# Altium project IMU_standalone.PrjPcb
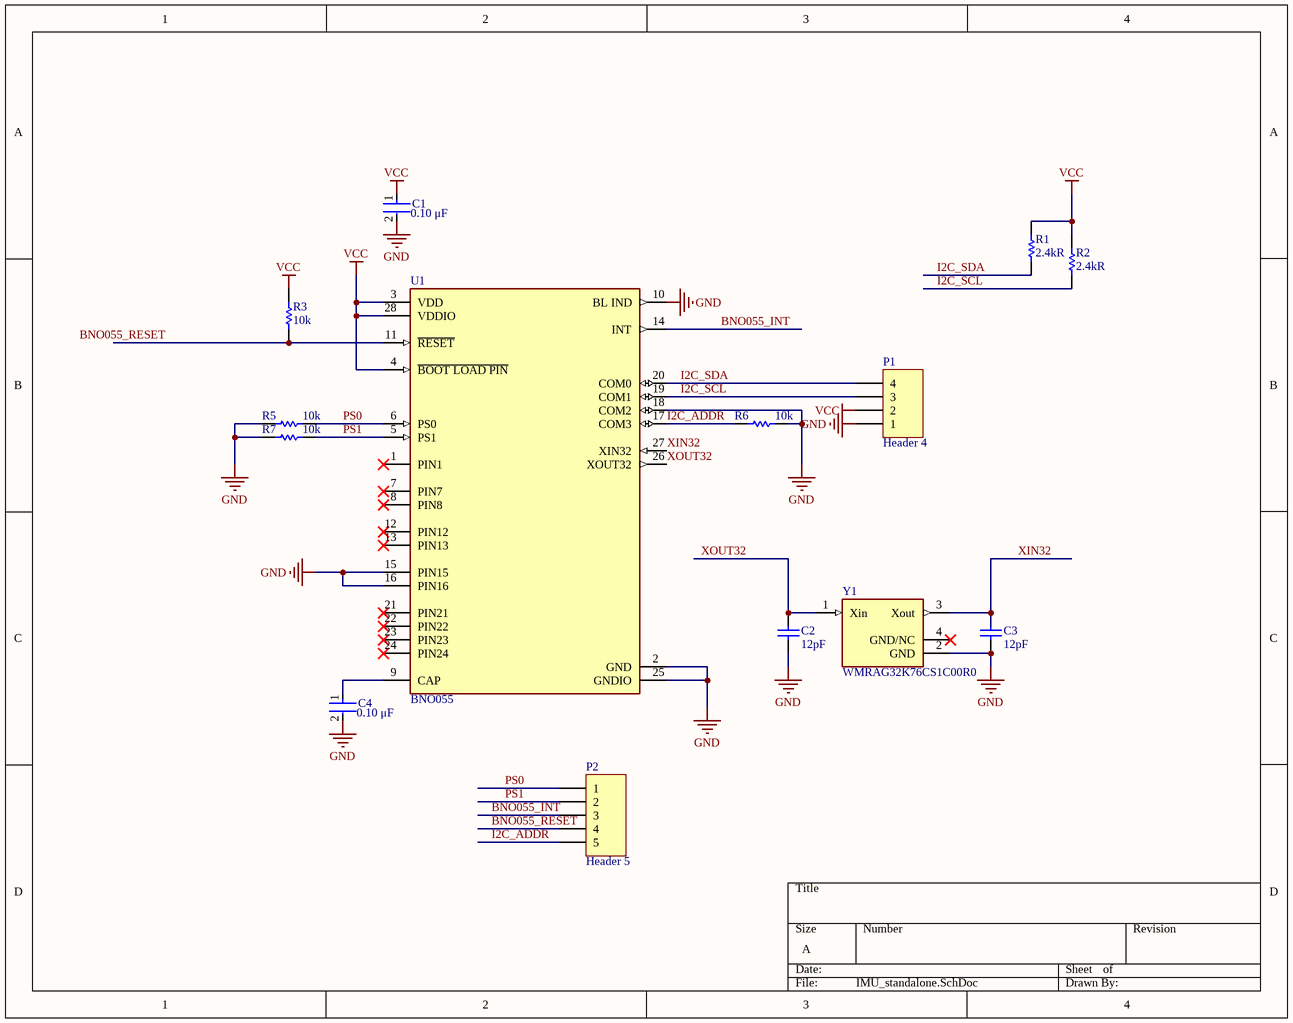
[diagram p0: IMU_standalone.SchDoc]
1 sheet, 14 parts. Net scope: global (net labels, ports and power ports of the same name join across sheets).
Board file: IMU_standalone.PcbDoc

## Sheet IMU_standalone.SchDoc
size A

### Parts
C1  Capacitance: 0.10 μF  [FP-C0603C-CF-MFG]  (hidden comment: C0603C104M4RAC7411)
C2  value 12pF  [CAPC1608X90X40NL10T20]  (hidden comment: CC0603JRNPO9BN120)
C3  value 12pF  [CAPC1608X90X40NL10T20]  (hidden comment: CC0603JRNPO9BN120)
C4  Capacitance: 0.10 μF  [FP-C0603C-CF-MFG]  (hidden comment: C0603C104M4RAC7411)
P1  Header 4  [HDR1X4]
P2  Header 5  [HDR1X5]
R1  value 2.4kR  [RESC1608X50X30ML20T20]  (hidden comment: RR0816P-242-D)
R2  value 2.4kR  [RESC1608X50X30ML20T20]  (hidden comment: RR0816P-242-D)
R3  value 10k  [RESC1609X55X30LL15T15]  (hidden comment: ERJ3EKF1002V)
R5  value 10k  [RESC1609X55X30LL15T15]  (hidden comment: ERJ3EKF1002V)
R6  value 10k  [RESC1609X55X30LL15T15]  (hidden comment: ERJ3EKF1002V)
R7  value 10k  [RESC1609X55X30LL15T15]  (hidden comment: ERJ3EKF1002V)
U1  BNO055  [FP-BNO055-MFG]
Y1  WMRAG32K76CS1C00R0  [FP-WMRAG32K76CS1C00R0-MFG]

### Nets
GND: C1.2 C2.1 C3.1 C4.2 P1.1 R5.1 R6.1 R7.1 U1.2(GND) U1.10(BL_IND) U1.15(PIN15) U1.16(PIN16) U1.18(COM2) U1.25(GNDIO) Y1.2(GND)
VCC: C1.1 P1.2 R1.2 R2.2 R3.2 U1.3(VDD) U1.4(~{BOOT_LOAD_PIN}) U1.28(VDDIO)
BNO055_INT: P2.3 U1.14(INT)
BNO055_RESET: P2.4 R3.1 U1.11(~{RESET})
I2C_ADDR: P2.5 R6.2 U1.17(COM3)
I2C_SCL: P1.3 R2.1 U1.19(COM1)
I2C_SDA: P1.4 R1.1 U1.20(COM0)
PS0: P2.1 R5.2 U1.6(PS0)
PS1: P2.2 R7.2 U1.5(PS1)
XIN32: C3.2 U1.27(XIN32) Y1.3(Xout)
XOUT32: C2.2 U1.26(XOUT32) Y1.1(Xin)
NetC4_1: C4.1 U1.9(CAP)

Not connected (* = marked no-connect by the designer): U1 1(PIN1)* 7(PIN7)* 8(PIN8)* 12(PIN12)* 13(PIN13)* 21(PIN21)* 22(PIN22)* 23(PIN23)* 24(PIN24)*; Y1 4(GND/NC)*

### Library data of the parts
C1 C4 = CMP-03020-016578-1: CAP CER 0.1UF 16V X7R 0603; Manufacturer: KEMET; Tolerance: 0.2; Value: 0.10 μF; Automotive Grade: Grade 1; Material: Ceramic; Temperature Coefficient: 30ppm/°C; RoHS: TRUE; Temperature: -55°C to +125°C; Automotive: Yes; Device Class L3: Ceramic Capacitors; Temperature Characteristic: X7R; Package: C0603C-CF; Digikey Description: CAP CER 0.1UF 16V X7R 0603; Manufacturer Part Number: C0603C104M4RAC7411; ComponentLink2URL: https://api.kemet.com/component-edge/download/datasheet/C0603C100J5GACAUTO.pdf; Mouser Description: Multilayer Ceramic Capacitors MLCC - SMD/SMT 16volts 0.1uF X7R 20%; Voltage Rating: 16 V; Temperature Range High: +125°C; Temperature Range Low: -55°C; Height: 0.87mm; Device Class L1: Passive Components; ComponentLink2Description: Datasheet; Lead Free: Yes; Category: Cap; Device Class L2: Capacitors; Octopart: https://octopart.com/c0603c104m4rac7411-kemet-9138805
C2 C3 = CMP-1659-00031-1: Chip Capacitor, 12 pF, +/- 5%, 50 V, -55 to 125 degC, 0603 (1608 Metric), RoHS, Tape and Reel; Tolerance: 1%; Voltage Rating: 250 V; Case\Package: Axial; Power Rating: 250 mW; Resistance: 475 kohm; Mount: Through Hole; Length: 0.248 inch; PackageReference: 0603; DatasheetVersion: Rev. 14, 07/2016; Packaging: Bulk; Max Operating Temperature: 155 degC; Min Operating Temperature: -55 degC; ComponentLink2Description: Datasheet; ComponentLink2URL: http://www.yageo.com/NewPortal/yageodocoutput?fileName=/pdf/MLCC/UPY-GP_NP0_16V-to-50V_14.pdf; ComponentLink1URL: http://www.yageo.com/; PackageDescription: 2-Pin Surface Mount Device, Body 1.6 x 0.8 mm; Package Quantity: 200; RoHSCompliant: true; ComponentLink1Description: Manufacturer URL
P1 = Header 4: Header, 4-Pin; LatestRevisionDate: 17-Jul-2002; LatestRevisionNote: Re-released for DXP Platform.; Publisher: Altium Limited
P2 = Header 5: Header, 5-Pin; LatestRevisionDate: 17-Jul-2002; LatestRevisionNote: Re-released for DXP Platform.; Publisher: Altium Limited
R1 R2 = CMP-2000-02561-1: Manufacturer: Susumu; Part Number: RR0816P-242-D
R3 R5-R7 = CMP-2000-07452-1: Chip Resistor, 10 KOhm, +/- 1%, 0.1 W, -55 to 155 degC, 0603 (1608 Metric), RoHS, Tape and Reel; Manufacturer: Panasonic; Voltage Rating: 75V; Case\/Package: 0603; Power Rating: 100mW; Resistance: 10KOhm; Temperature Coefficient: 100ppm\/degreesC; Number of Pins: 2; Package Reference: 603; Depth: 0.8mm; Mount: SurfaceMount; Package Description: 2-Pin Surface Mount Device, Body 1.6 x 0.85 mm; Datasheet Version: 02/2017; Length: 1.6mm; Lead Free: LeadFree; Height: 0.45mm; Number of Terminations: 2; Max Power Dissipation: 100mW; Min Operating Temperature: -55degC; Datasheet URL: https://industrial.panasonic.com/cdbs/www-data/pdf/RDA0000/AOA0000C304.pdf; Termination: SMD/SMT; Case Code (Metric): 1608; Case Code (Imperial): 0603; Tolerance: 1%; Max Operating Temperature: 155degC; RoHSCompliant: true; Voltage Rating (DC): 75V; Radiation Hardening: No; Packaging: TapeandReel; Composition: ThickFilm; Mounting Technology: SurfaceMount; Manufacturer URL: http://www.panasonic.com/; Width: 0.031inch; REACH SVHC: NoSVHC; Contact Plating: Tin; Military Standard: Not; Package Quantity: 1
U1 = CMP-191067-000002-1: IMU ACCEL/GYRO/MAG I2C 28LGA; Manufacturer: Bosch Sensortech; Max Supply Voltage: 3.6V; Voltage: 1.7~3.6V; Operating Supply Current: 12.3mA; Gyro Sensitivity: 16LSB/°/s; Sensor Type: Accelerometer,Gyroscope,Magnetometer; Accel Sensitivity: 0.001LSB/g; Min Supply Voltage: 1.7V; Accel Range: 2/4/8/16g; Accel Resolution: 14bits; Sensor Output: I2C,UART; Gyro Range: 125/250/500/1000/2000°/s; Mag Sense Range: 1300-2500uT; Octopart: https://octopart.com/bno055-bosch+sensortec-50309911; Height: 1.18mm; Automotive: No; Mouser Description: BNO055 Series 1.7 to 3.6 V Intelligent 9-Axis Absolute Orientation Sensor-LGA-28; Lead Free: Yes; Temperature Range High: +85°C; Ambient Temperature Range Low: -40°C; Ambient Temperature Range High: +85°C; Device Class L1: Sensors; Device Class L3: Inertial Measurement Units (IMUs); ComponentLink2URL: https://ae-bst.resource.bosch.com/media/_tech/media/datasheets/BST-BNO055-DS000.pdf; Temperature Range Low: -40°C; Manufacturer Part Number: BNO055; Digikey Description: IMU ACCEL/GYRO/MAG I2C 28LGA; Device Class L2: Motion Sensors; RoHS: TRUE; Category: IC; Temperature: -40°C to +85°C; ComponentLink2Description: Datasheet; Package: 0
Y1 = CMP-06054-000002-1: MEMS Resonator; Manufacturer: Murata; Tolerance: 20ppm; Frequency: 32.768kHz; Esr: 75kΩ; Load Capacitance: 8pF; Temperature Range High: +85°C; Manufacturer Part Number: WMRAG32K76CS1C00R0; Device Class L2: Crystals / Oscillators; Category: Crys; ComponentLink2URL: https://www.murata.com/en-us/products/productdetail?partno=WMRAG32K76CS1C00R0; Package: WMRAG32K76CS1C00R0; Temperature: -30°C to +85°C; Automotive: No; Device Class L1: Passive Components; Octopart: https://octopart.com/wmrag32k76cs1c00r0-murata-103936783; ComponentLink2Description: Datasheet; RoHS: TRUE; Lead Free: Yes; Device Class L3: Crystals; Footprint Url: https://forum.upverter.com/uploads/default/original/3X/c/9/c928dfaf44ae48bfe51164a60c1d28063cd1860b.pdf; Temperature Range Low: -30°C